# Altium project e3_ej5_altium.PrjPcb
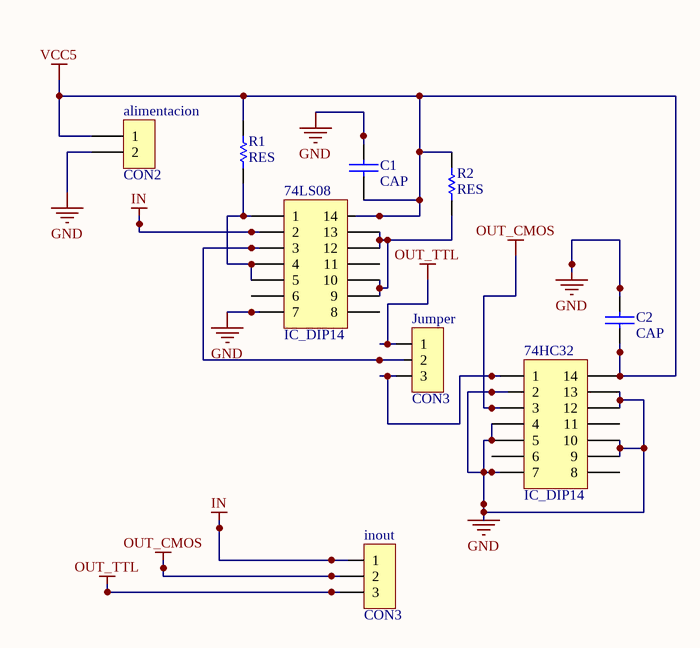
[diagram p0: e3_ej5_esquematico.SchDoc]
1 sheet, 9 parts. Net scope: global (net labels, ports and power ports of the same name join across sheets).
Board file: e3_ej5_placa.PcbDoc

## Sheet e3_ej5_esquematico.SchDoc
size A

### Parts
74HC32  IC_DIP14  [DIP14]
74LS08  IC_DIP14  [DIP14]
alimentacion  CON2  [SIP2]
C1  CAP  [CAP200]
C2  CAP  [CAP200]
inout  CON3  [SIP3]
Jumper  CON3  [SIP3]
R1  RES  [RES300]
R2  RES  [RES300]

### Nets
GND: 74HC32.2 74HC32.4 74HC32.5 74HC32.7 74HC32.9 74HC32.10 74HC32.12 74HC32.13 74LS08.7 alimentacion.2 C1.1 C2.1
IN: 74LS08.2 inout.1
OUT_CMOS: 74HC32.3 inout.2
OUT_TTL: inout.3 Jumper.1
VCC5: 74HC32.14 74LS08.14 alimentacion.1 C1.2 C2.2 R1.2 R2.2
Net74HC32_1: 74HC32.1 Jumper.3
Net74LS08_1: 74LS08.1 74LS08.4 74LS08.5 R1.1
Net74LS08_3: 74LS08.3 Jumper.2
Net74LS08_9: 74LS08.9 74LS08.10 74LS08.12 74LS08.13 R2.1

Not connected (* = marked no-connect by the designer): 74HC32 6 8 11; 74LS08 6 8 11